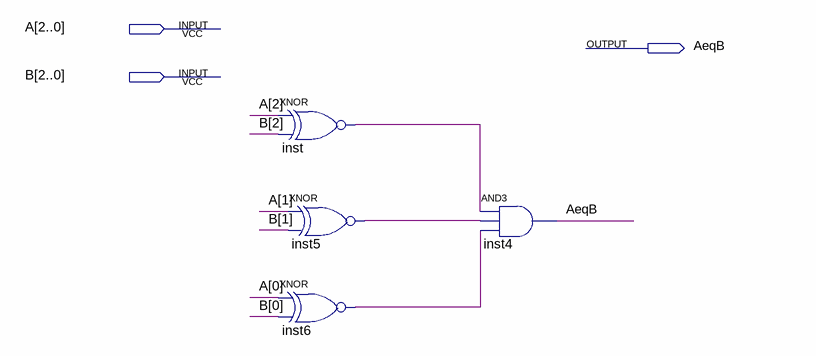
[diagram p0: schematic sheet]
// Quartus schematic g14_3bitComp.bdf as structural Verilog: 4 symbols, 3 pins
module g14_3bitComp (
  input  [2:0] A,
  input  [2:0] B,
  output AeqB
);

  wire inst5_out, inst6_out, inst_out;

  xnor inst (inst_out, A[2], B[2]);
  xnor inst5 (inst5_out, A[1], B[1]);
  xnor inst6 (inst6_out, A[0], B[0]);
  and inst4 (AeqB, inst_out, inst5_out, inst6_out);
endmodule
